# EasyEDA Pro project eLight_pro.eprj

# Schematic SCH
Create Date: 2023-01-14; Page Name: P1; Project Name: eLight_pro; Schematic Name: SCH; Update Date: 2023-04-07; Company: 嘉立创EDA; Page Size: A4; Version: V1.0
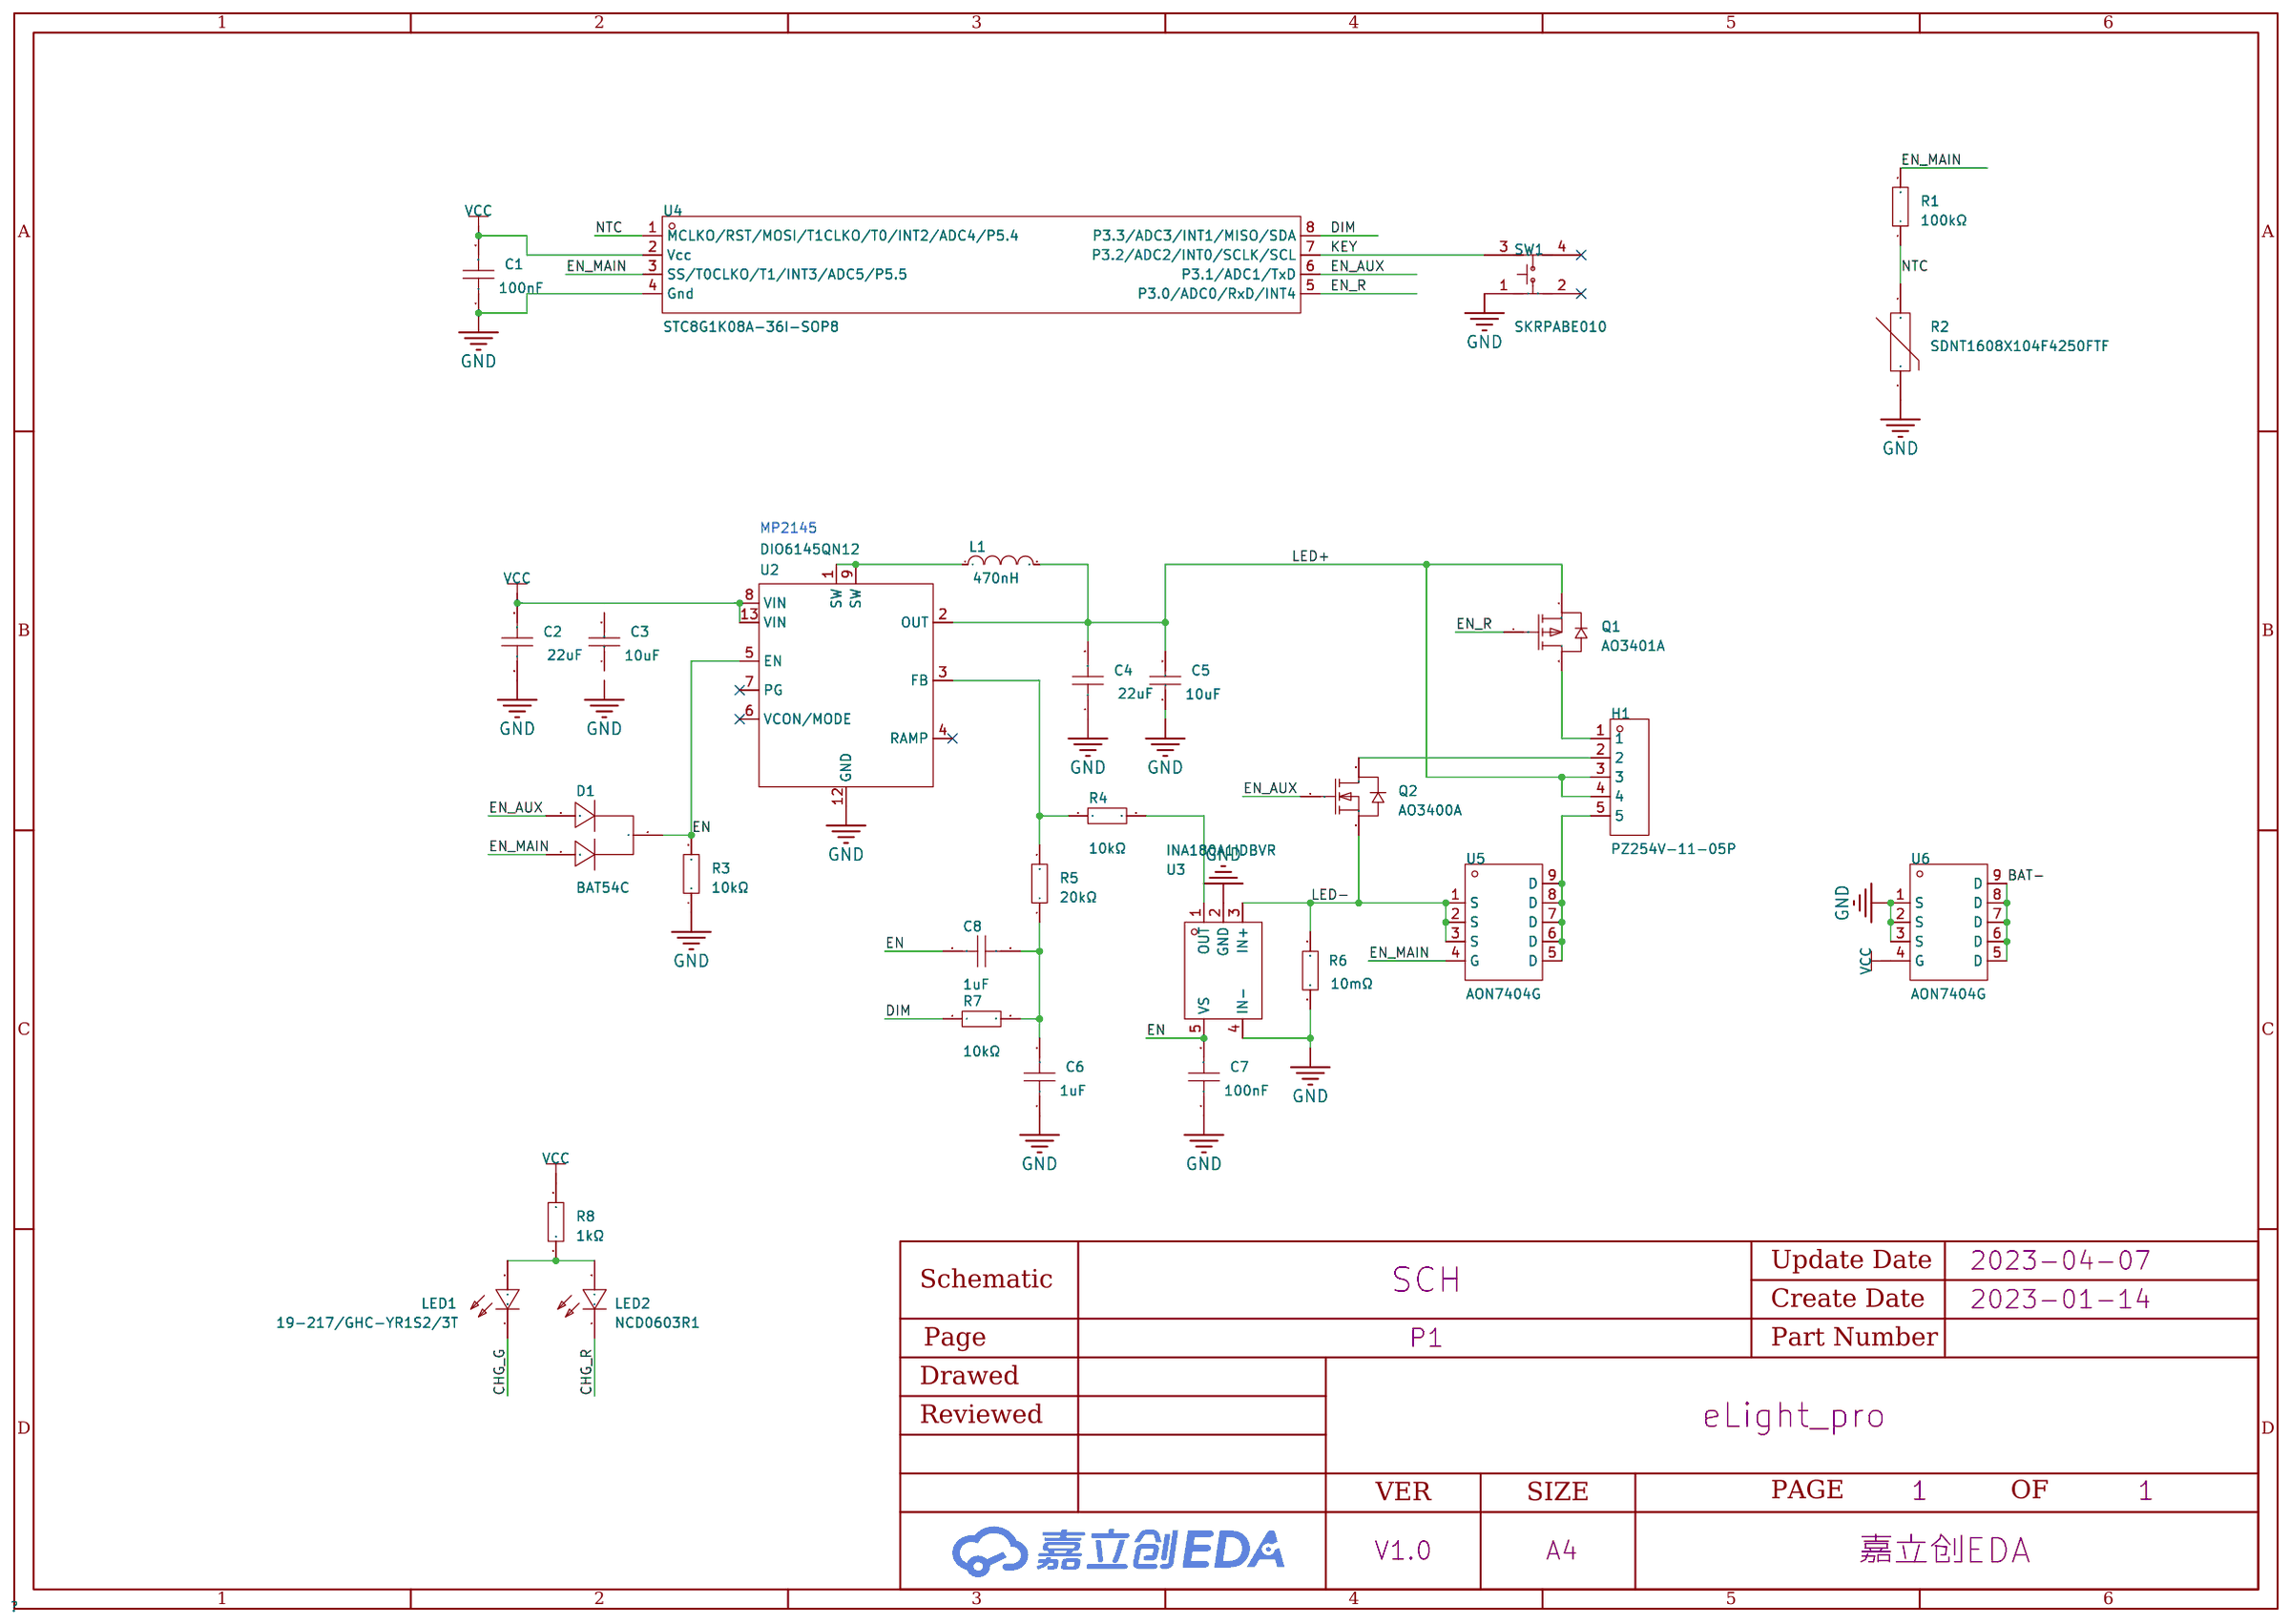
[diagram p0: schematic sheet]

## Parts
C1  100nF  [C0603]
C2  22uF  [C0805]
C3  10uF  [C0603]
C4  22uF  [C0805]
C5  10uF  [C0603]
C6  1uF  [C0603]
C7  100nF  [C0603]
C8  1uF  [C0603]
D1  BAT54C  [SOT-23-3_L2.9-W1.6-P1.90-LS2.8-BR]
H1  PZ254V-11-05P  [HDR-TH_5P-P2.54-V-M]
L1  470nH  [IND-SMD_L4.4-W4.2]
LED1  19-217/GHC-YR1S2/3T  [LED0603-RD]
LED2  NCD0603R1  [LED0603-RD_RED]
Q1  AO3401A  [SOT-23_L2.9-W1.3-P1.90-LS2.4-BR]
Q2  AO3400A  [SOT-23-3_L2.9-W1.6-P1.90-LS2.8-BR]
R1  100kΩ  [R0603]
R2  SDNT1608X104F4250FTF  [R0603]
R3  10kΩ  [R0603]
R4  10kΩ  [R0603]
R5  20kΩ  [R0603]
R6  10mΩ  [R1206]
R7  10kΩ  [R0603]
R8  1kΩ  [R0603]
SW1  SKRPABE010  [KEY-SMD_4P-L4.2-W3.2-P2.20-LS4.6]
U2  DIO6145QN12  [QFN-12_L3.0-W2.0-P0.50_DIO6145QN12]
U3  INA180A1IDBVR  [SOT-23-5_L3.0-W1.7-P0.95-LS2.8-BR]
U4  STC8G1K08A-36I-SOP8  [SOP-8_L5.0-W4.0-P1.27-LS6.0-BL]
U5  AON7404G  [DFN-8_L3.0-W3.0-P0.65-BL-2]
U6  AON7404G  [DFN-8_L3.0-W3.0-P0.65-BL-2]

## Library data of the parts
C1 C7 = CC0603KRX7R9BB104: 容值:100nF;精度:±10%;额定电压:50V;材质(温度系数):X7R;; LCSC Part Name: 100nF ±10% 50V; Supplier Part: C14663; Manufacturer: YAGEO(国巨); Supplier Footprint: 0603; JLCPCB Part Class: Basic Part; Datasheet: https://atta.szlcsc.com/upload/public/pdf/source/20170116/1484561234239.pdf; Supplier: LCSC; Tolerance: ±10%; Voltage Rated: 50V; Temperature Coefficient: X7R
C2 C4 = CL21A226MAQNNNE_C45783: 容值:22uF;精度:±20%;额定电压:25V;材质(温度系数):X5R;; LCSC Part Name: 22uF ±20% 25V; Supplier Part: C45783; Manufacturer: SAMSUNG(三星); Manufacturer Part: CL21A226MAQNNNE; Supplier Footprint: 0805; JLCPCB Part Class: Basic Part; Datasheet: https://atta.szlcsc.com/upload/public/pdf/source/20160103/1457707727161.pdf; Supplier: LCSC; Tolerance: ±20%; Voltage Rated: 25V; Temperature Coefficient: X5R
C3 C5 = CL10A106KP8NNNC: 容值:10uF;精度:±10%;额定电压:10V;材质(温度系数):X5R;; LCSC Part Name: 10uF ±10% 10V; Supplier Part: C19702; Manufacturer: SAMSUNG(三星); Supplier Footprint: 0603; JLCPCB Part Class: Basic Part; Datasheet: https://atta.szlcsc.com/upload/public/pdf/source/20160103/1457707703378.pdf; Supplier: LCSC; Tolerance: ±10%; Voltage Rated: 10V; Temperature Coefficient: X5R
C6 C8 = CL10A105KB8NNNC: 温度系数:X5R;精度:±10%;额定电压:50V;容值:1uF;; LCSC Part Name: 1uF ±10% 50V; Supplier Part: C15849; Manufacturer: SAMSUNG(三星); Supplier Footprint: 0603; JLCPCB Part Class: Basic Part; Datasheet: https://atta.szlcsc.com/upload/public/pdf/source/20160103/1457707679084.pdf; Supplier: LCSC; Tolerance: ±10%; Voltage Rated: 50V; Temperature Coefficient: X5R
D1 = BAT54C_C2135: 二极管配置:-;直流反向耐压(Vr):30V;平均整流电流(Io):200mA;正向压降(Vf):1V@100mA;反向电流(Ir):-;; LCSC Part Name: 30V 200mA 1V@100mA; Supplier Part: C2135; Manufacturer: CJ(江苏长电/长晶); Supplier Footprint: SOT-23; JLCPCB Part Class: Extended Part; Datasheet: https://atta.szlcsc.com/upload/public/pdf/source/20140809/1457707208935.pdf; Supplier: LCSC; Reverse Voltage (Vr): 30V; Average Rectified Current (Io): 200mA; Forward Voltage (Vf@If): 1V@100mA
H1 = PZ254V-11-05P: 排数:单排;总PIN位数:5;间距:2.54mm;插针结构:1x5P;行距:-;安装类型:直插;圆针/方针:方针;额定电流:-;额定电压:-;配合针长度:6mm;塑高:2.5mm;端接针长度:3mm;触头材质:黄铜;触头镀层:-;工作温度范围:-40℃~+105℃;颜色:黑色;; LCSC Part Name: 2.54mm 1x5P 直插 方针; Supplier Part: C492404; Manufacturer: XFCN(兴飞); Supplier Footprint: 插件,P=2.54mm; JLCPCB Part Class: Extended Part; Datasheet: https://atta.szlcsc.com/upload/public/pdf/source/20200309/C492404_E51533260F8710EFF5D4617281164C1D.pdf; Supplier: LCSC; Number of Rows: 单排; Number of Pins: 5; Pitch: 2.54mm; Pin Structure: 1x5P; Mounting Type: 直插; Circluar Pins/Square Pins: 方针; Length of Mating Pin: 6mm; Insulation Height: 2.5mm; Length of End Connection Pin: 3mm; Contact Material: 黄铜; Operating Temperature Range: -40℃~+105℃; Color: 黑色
L1 = FXL0420-R47-M: 电感值:470nH;精度:±20%;额定电流:7.5A;饱和电流(Isat):9.5A;直流电阻(DCR):12.5mΩ;; LCSC Part Name: 470nH ±20% 7.5A 12.5mΩ; Supplier Part: C167200; Manufacturer: cjiang(长江微电); Supplier Footprint: SMD,4.4x4.2x1.8mm; JLCPCB Part Class: Extended Part; Datasheet: https://atta.szlcsc.com/upload/public/pdf/source/20190322/C167200_20D2BEC67E3458D1D3C41374BE294EB4.pdf; Supplier: LCSC; Tolerance: ±20%; Rated Current: 7.5A; Saturation Current (Isat): 9.5A; DC Resistance (DCR): 12.5mΩ
LED1 = 19-217/GHC-YR1S2/3T: 发光颜色:翠绿;二极管配置:-;透镜颜色:无色透明;主波长:520nm~535nm;峰值波长:518nm;色温:-;测试电流:20mA;功率:110mW;发光角度:120°;安装方式:-;工作温度:-40℃~+85℃;; LCSC Part Name: 翠绿 520nm~535nm; Supplier Part: C72043; Manufacturer: EVERLIGHT(亿光); Supplier Footprint: 0603; JLCPCB Part Class: Basic Part; Datasheet: https://atta.szlcsc.com/upload/public/pdf/source/20160507/1462613613780.pdf; Supplier: LCSC; Emitted Color: 翠绿; Lens Color: 无色透明; Dominant Wavelength: 520nm~535nm; Peak Wavelength: 518nm; Forward Current: 20mA; Power Dissipation: 110mW; Viewing Angle: 120°; Operating Temperature: -40℃~+85℃
LED2 = NCD0603R1_C84263: 发光颜色:红灯;; LCSC Part Name: 红灯; Supplier Part: C84263; Manufacturer: 国星光电; Supplier Footprint: 0603; JLCPCB Part Class: Extended Part; Datasheet: https://atta.szlcsc.com/upload/public/pdf/source/20200820/C84263_DABC6A75E58F576973B407FDBA283D60.pdf; Supplier: LCSC; Emitted Color: 红灯
Q1 = AO3401A_C15127: 类型:P沟道;漏源电压(Vdss):30V;连续漏极电流(Id):4A;功率(Pd):1.4W;导通电阻(RDS(on)@Vgs,Id):44mΩ@10V,4.3A;阈值电压(Vgs(th)@Id):1.3V@250uA;; LCSC Part Name: P沟道 30V 4A; Supplier Part: C15127; Manufacturer: AOS; Supplier Footprint: SOT-23-3L; JLCPCB Part Class: Basic Part; Datasheet: https://atta.szlcsc.com/upload/public/pdf/source/20160507/1462613609053.pdf; Supplier: LCSC; Type: P沟道; Drain Source Voltage (Vdss): 30V; Continuous Drain Current (Id): 4A; Power Dissipation (Pd): 1.4W; Drain Source On Resistance (RDS(on)@Vgs,Id): 44mΩ@10V,4.3A; Gate Threshold Voltage (Vgs(th)@Id): 1.3V@250uA
Q2 = AO3400A_C20917: 类型:N沟道;漏源电压(Vdss):30V;连续漏极电流(Id):5.7A;功率(Pd):1.4W;导通电阻(RDS(on)@Vgs,Id):26.5mΩ@10V,5.7A;阈值电压(Vgs(th)@Id):1.5V@250uA;; LCSC Part Name: N沟道 30V 5.7A; Supplier Part: C20917; Manufacturer: AOS; Supplier Footprint: SOT-23; JLCPCB Part Class: Basic Part; Datasheet: https://atta.szlcsc.com/upload/public/pdf/source/20140107/1457706668533.pdf; Supplier: LCSC; Type: N沟道; Drain Source Voltage (Vdss): 30V; Continuous Drain Current (Id): 5.7A; Power Dissipation (Pd): 1.4W; Drain Source On Resistance (RDS(on)@Vgs,Id): 26.5mΩ@10V,5.7A; Gate Threshold Voltage (Vgs(th)@Id): 1.5V@250uA
R1 = 0603WAF1003T5E: 电阻类型:厚膜电阻;阻值:100kΩ;精度:±1%;功率:100mW;温度系数:±100ppm/℃;最大工作电压:75V;工作温度范围:-55℃~+155℃;; LCSC Part Name: 100kΩ ±1% 100mW; Supplier Part: C25803; Manufacturer: UNI-ROYAL(厚声); Supplier Footprint: 0603; JLCPCB Part Class: Basic Part; Datasheet: https://atta.szlcsc.com/upload/public/pdf/source/20200306/C422600_1E6D84923E4A46A82E41ADD87F860B5C.pdf; Supplier: LCSC; Type: 厚膜电阻; Tolerance: ±1%; Power(Watts): 100mW; Temperature Coefficient: ±100ppm/℃; Overload Voltage (Max): 75V; Operating Temperature Range: -55℃~+155℃
R2 = SDNT1608X104F4250FTF: 阻值(25℃):100kΩ;电阻精度:±1%;B值精度:±1%;B值(25℃/50℃):4250K;功率:100mW;最大稳态电流(25℃):100uA;B值(25℃/75℃):-;B值(25℃/85℃):-;B值(25℃/100℃):-;工作温度:-55℃~+125℃;; LCSC Part Name: 100kΩ 电阻精度:±1% 4250K; Supplier Part: C95955; Manufacturer: Sunlord(顺络); Supplier Footprint: 0603; JLCPCB Part Class: Extended Part; Datasheet: https://atta.szlcsc.com/upload/public/pdf/source/20210916/BF106A3565EDFEB141CB3E0EA3A661F8.pdf; Supplier: LCSC; Resistance @ 25℃: 100kΩ; Resistance Tolerance: ±1%; B Constant Tolerance: ±1%; B Constant (25℃/50℃): 4250K; Power: 100mW; Steady State Current (Max): 100uA; Operating Temperature: -55℃~+125℃
R3 R4 R7 = 0603WAF1002T5E: 电阻类型:厚膜电阻;阻值:10kΩ;精度:±1%;功率:100mW;温度系数:±100ppm/℃;最大工作电压:75V;工作温度范围:-55℃~+155℃;; LCSC Part Name: 10kΩ ±1% 100mW; Supplier Part: C25804; Manufacturer: UNI-ROYAL(厚声); Supplier Footprint: 0603; JLCPCB Part Class: Basic Part; Datasheet: https://atta.szlcsc.com/upload/public/pdf/source/20200306/C422600_1E6D84923E4A46A82E41ADD87F860B5C.pdf; Supplier: LCSC; Type: 厚膜电阻; Tolerance: ±1%; Power(Watts): 100mW; Temperature Coefficient: ±100ppm/℃; Overload Voltage (Max): 75V; Operating Temperature Range: -55℃~+155℃
R5 = 0603WAF2002T5E: 精度:±1%;温度系数:±100ppm/℃;阻值:20kΩ;功率:1/10W;最大工作电压:75V;工作温度范围:-55℃~+155℃;; LCSC Part Name: 20KΩ ±1%; Supplier Part: C4184; Manufacturer: UNI-ROYAL(厚声); Supplier Footprint: 0603; JLCPCB Part Class: Basic Part; Datasheet: https://atta.szlcsc.com/upload/public/pdf/source/20170920/C4184_1505887495503980652.pdf; Supplier: LCSC; Tolerance: ±1%; Temperature Coefficient: ±100ppm/℃; Power(Watts): 1/10W; Overload Voltage (Max): 75V; Operating Temperature Range: -55℃~+155℃; Type: 厚膜电阻
R6 = FMF06FTHR010-LH: 阻值:10mΩ;精度:±1%;功率:1W;温度系数:±70ppm/℃;; LCSC Part Name: 10mΩ ±1% 1W; Supplier Part: C105362; Manufacturer: PSA(信昌电陶); Supplier Footprint: 1206; JLCPCB Part Class: Extended Part; Datasheet: https://atta.szlcsc.com/upload/public/pdf/source/20170410/1491788444486.pdf; Supplier: LCSC; Tolerance: ±1%; Power(Watts): 1W; Temperature Coefficient: ±70ppm/℃
R8 = 0603WAF1001T5E: 电阻类型:厚膜电阻;阻值:1kΩ;精度:±1%;功率:100mW;温度系数:±100ppm/℃;最大工作电压:75V;工作温度范围:-55℃~+155℃;; LCSC Part Name: 1kΩ ±1% 100mW; Supplier Part: C21190; Manufacturer: UNI-ROYAL(厚声); Supplier Footprint: 0603; JLCPCB Part Class: Basic Part; Datasheet: https://atta.szlcsc.com/upload/public/pdf/source/20200306/C422600_1E6D84923E4A46A82E41ADD87F860B5C.pdf; Supplier: LCSC; Type: 厚膜电阻; Tolerance: ±1%; Power(Watts): 100mW; Temperature Coefficient: ±100ppm/℃; Overload Voltage (Max): 75V; Operating Temperature Range: -55℃~+155℃
SW1 = SKRPABE010: 触点电流:50mA;额定电压(DC):16V;电路结构:单刀单掷;按钮作用方向:顶部触动;致动器样式:椭圆形按钮;照明颜色:-;开关长度:4.2mm;开关宽度:3.2mm;开关高度:2.5mm;; LCSC Part Name: 3.2*4.2*2.5，1.57N; Supplier Part: C115360; Manufacturer: ALPSALPINE(阿尔卑斯阿尔派); Supplier Footprint: SMD; JLCPCB Part Class: Extended Part; Datasheet: https://atta.szlcsc.com/upload/public/pdf/source/20170620/1497944816225.pdf; Supplier: LCSC; Contact Current: 50mA; Voltage Rating (DC): 16V; Circuit: 单刀单掷; Actuator Orientation: 顶部触动; Actuator Style: 椭圆形按钮; Switch Length: 4.2mm; Switch Width: 3.2mm; Switch Height: 2.5mm
U2 = DIO6145QN12: Supplier Part: C2980987; Manufacturer: DIOO(帝奥微); Supplier Footprint: QFN-12(2x3); JLCPCB Part Class: Extended Part; Supplier: LCSC
U3 = INA180A1IDBVR: INA180 INA180 多通道电流感应放大器; Supplier Part: C122228; Manufacturer: TI(德州仪器); Supplier Footprint: SOT-23-5; JLCPCB Part Class: Extended Part; Datasheet: https://atta.szlcsc.com/upload/public/pdf/source/20190308/C122228_29623D128362F1CBFB59AB6E2997A932.pdf; Supplier: LCSC
U4 = STC8G1K08A-36I-SOP8: CPU内核:51系列;CPU最大主频:-;工作电压范围:1.9V~5.5V;内部振荡器:有;外部时钟频率范围:-;程序 FLASH容量:8KB;RAM总容量:1.25KB;EEPROM/数据 FLASH容量:4KB;GPIO端口数量:6;ADC(单元数/通道数/位数):1@x6ch/10bit;DAC(单元数/通道数/位数):-;(E)PWM(单元数/通道数/位数):-;8位Timer数量:-;16位Timer数量:2;32位Timer数量:-;内部比较器数量:-;U(S)ART路数:1;I2C路数:1;; LCSC Part Name: 51系列 闪存：8KB RAM：1.25KB; Supplier Part: C915663; Manufacturer: STC(宏晶); Supplier Footprint: SOP-8-4.0mm; JLCPCB Part Class: Extended Part; Datasheet: https://atta.szlcsc.com/upload/public/pdf/source/20201105/C713818_1666C7558605C197DBF08446D241F69F.pdf; Supplier: LCSC; CPU Core: 51系列; Supply Voltage Range: 1.9V~5.5V; Internal Oscillator: 有; Program FLASH Size: 8KB; RAM Size: 1.25KB; EEPROM/Data FLASH Size: 4KB; GPIO Ports Number: 6; ADC (Units/Channels/bits): 1@x6ch/10bit; 16Bit Timer Number: 2; U(S)ART Number: 1; I2C Number: 1; (Q)SPI Number: 1; Peripherals / Functions / Protocol Stacks: 低电压检测；看门狗；CCP捕获/比较；除法器；乘法器; Operating Temperature Range: -40℃~+85℃
U5 U6 = AON7404G: 类型:N沟道;漏源电压(Vdss):20V;连续漏极电流(Id):20A；20A;功率(Pd):5W；28W;导通电阻(RDS(on)@Vgs,Id):5.3mΩ@20A,4.5V;阈值电压(Vgs(th)@Id):1.25V@250uA;栅极电荷(Qg@Vgs):45nC@4.5V;输入电容(Ciss@Vds):3.3nF@10V;工作温度:-55℃~+150℃@(Tj);; LCSC Part Name: N沟道 20V 20A 20A; Supplier Part: C3288325; Manufacturer: AOS; Supplier Footprint: DFN-8_EP(3x3); Supplier: LCSC; Type: N沟道; Drain Source Voltage (Vdss): 20V; Continuous Drain Current (Id): 20A；20A; Power Dissipation (Pd): 5W；28W; Drain Source On Resistance (RDS(on)@Vgs,Id): 5.3mΩ@20A,4.5V; Gate Threshold Voltage (Vgs(th)@Id): 1.25V@250uA; Total Gate Charge (Qg@Vgs): 45nC@4.5V; Input Capacitance (Ciss@Vds): 3.3nF@10V; Operating Temperature: -55℃~+150℃@(Tj)

## Nets
GND: C1.1 C2.1 C4.1 C5.1 C6.1 C7.1 R2.1 R3.1 R6.1 SW1.1 U2.12(GND) U3.2(GND) U3.4(IN-) U4.4(Gnd) U6.1(S) U6.2(S) U6.3(S)
VCC: C1.2 C2.2 R8.2 U2.8(VIN) U2.13(VIN) U4.2(Vcc) U6.4(G)
BAT-: U6.5(D) U6.6(D) U6.7(D) U6.8(D) U6.9(D)
CHG_G: LED1.1(C)
CHG_R: LED2.1(K)
DIM: R7.1 U4.8(P3.3/ADC3/INT1/MISO/SDA)
EN: C7.2 C8.2 D1.3(K) R3.2 U2.5(EN) U3.5(VS)
EN_AUX: D1.1(A1) Q2.1(G) U4.6(P3.1/ADC1/TxD)
EN_MAIN: D1.2(A2) R1.2 U4.3(SS/T0CLKO/T1/INT3/ADC5/P5.5) U5.4(G)
EN_R: Q1.1(G) U4.5(P3.0/ADC0/RxD/INT4)
KEY: SW1.3 U4.7(P3.2/ADC2/INT0/SCLK/SCL)
LED+: C4.2 C5.2 H1.3 H1.4 L1.2 Q1.2(S) U2.2(OUT)
LED-: Q2.2(S) R6.2 U3.3(IN+) U5.1(S) U5.2(S) U5.3(S)
NTC: R1.1 R2.2 U4.1(MCLKO/RST/MOSI/T1CLKO/T0/INT2/ADC4/P5.4)
$1N3392: R4.1 R5.2 U2.3(FB)
$1N43155: L1.1 U2.1(SW) U2.9(SW)
$1N44128: R4.2 U3.1(OUT)
$1N45108: LED1.2(A) LED2.2(A) R8.1
$1N49420: H1.5 U5.5(D) U5.6(D) U5.7(D) U5.8(D) U5.9(D)
$1N49493: H1.2 Q2.3(D)
$1N49497: H1.1 Q1.3(D)
$1N54255: C6.2 C8.1 R5.1 R7.2

Not connected (* = marked no-connect by the designer): C3 1 2; SW1 2* 4*; U2 4(RAMP)* 6(VCON/MODE)* 7(PG)*

## Notes on the sheet
- MP2145

# Board PCB
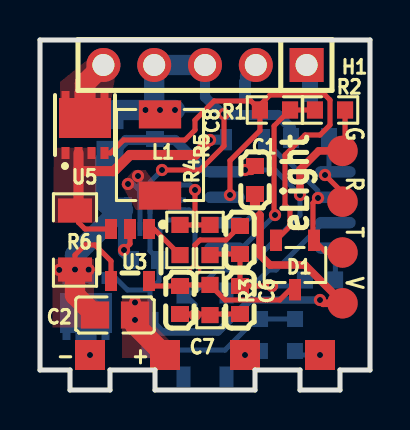
[diagram p1: board, top side]
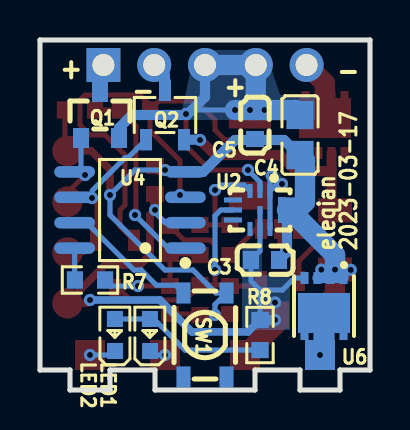
[diagram p2: board, bottom side, seen from below]

Outline 16.5 x 17.5 mm; copper layers: Top Layer, Bottom Layer. Coordinates in mm from the lower left corner of the outline.
Outline path: 0,17.5 0,1 1.5,1 1.5,0 3.5,0 3.5,1 5.75,1 5.75,0 10.75,0 10.75,1 13,1 13,0 15,0 15,1 16.5,1 16.5,17.5 0,17.5
Stack: Top Layer 0.035mm / Dielectric1 0.91mm FR4 er 4.5 / Bottom Layer 0.035mm

## Design rules (mm)
template: 用户自定义配置
spacing safeClearance (default): track to track 0.152, other pairs 0.152 to 0.3
track width trackWidth (default): min 0.127, default 0.254, max 2.54
differential pair differentialPair (default): width min 0.127, default 0.254, max 2.54; gap min 0.152, default 0.152
via viaSize (default): diameter min 0.5, default 0.61, max 10; hole min 0.3, default 0.305, max 5.999
net GND uses copperRegion1
net LED+ uses copperRegion1

## Placement (name value [footprint] x y rotation side)
C1  100nF  [C0603]  10.75 10.5 270 top
C2  22uF  [C0805]  3.75 3.75 0 top
C3  10uF  [C0603]  5.25 6.5 0 bottom
C4  22uF  [C0805]  3.5 12.75 90 bottom
C5  10uF  [C0603]  5.75 13.25 90 bottom
C6  1uF  [C0603]  10 4.5 90 top
C7  100nF  [C0603]  7 4.5 90 top
C8  1uF  [C0603]  10 7.5 90 top
D1  BAT54C  [SOT-23-3_L2.9-W1.6-P1.90-LS2.8-BR]  12.75 6.25 90 top
H1  PZ254V-11-05P  [HDR-TH_5P-P2.54-V-M]  8.25 16.25 180 top
L1  470nH  [IND-SMD_L4.4-W4.2]  6 11.75 270 top
LED1  19-217/GHC-YR1S2/3T  [LED0603-RD]  11 2.75 90 bottom
LED2  NCD0603R1  [LED0603-RD_RED]  12.75 2.75 90 bottom
NOREF  -  [Pad_e53]  2.5 1.75 0 top
NOREF#2  -  [Pad_e2023]  15.12 4.34 270 top
NOREF#3  -  [Pad_e71]  14 1.75 0 top
NOREF#4  -  [Pad_e54]  6.25 1.75 0 top
NOREF#5  -  [Pad_e75]  2.5 1.75 0 top
NOREF#6  -  [Pad_e663]  15.12 6.88 270 top
NOREF#7  -  [Pad_e55]  10.25 1.75 0 top
NOREF#8  -  [Pad_e660]  15.12 9.42 270 top
NOREF#9  -  [Pad_e664]  15.12 11.96 270 top
Q1  AO3401A  [SOT-23_L2.9-W1.3-P1.90-LS2.4-BR]  13.5 13.75 270 bottom
Q2  AO3400A  [SOT-23-3_L2.9-W1.6-P1.90-LS2.8-BR]  10.25 13.75 270 bottom
R1  100kΩ  [R0603]  11.75 14 180 top
R2  SDNT1608X104F4250FTF  [R0603]  14.5 14 180 top
R3  10kΩ  [R0603]  8.5 4.5 90 top
R4  10kΩ  [R0603]  7 7.5 270 top
R5  20kΩ  [R0603]  8.5 7.5 90 top
R6  10mΩ  [R1206]  1.75 7.5 90 top
R7  10kΩ  [R0603]  14 5.5 180 bottom
R8  1kΩ  [R0603]  5.5 2.75 90 bottom
SW1  SKRPABE010  [KEY-SMD_4P-L4.2-W3.2-P2.20-LS4.6]  8.25 2.75 270 bottom
U2  DIO6145QN12  [QFN-12_L3.0-W2.0-P0.50_DIO6145QN12]  5.5 9 270 bottom
U3  INA180A1IDBVR  [SOT-23-5_L3.0-W1.7-P0.95-LS2.8-BR]  4.5 6.75 90 top
U4  STC8G1K08A-36I-SOP8  [SOP-8_L5.0-W4.0-P1.27-LS6.0-BL]  12 9 90 bottom
U5  AON7404G  [DFN-8_L3.0-W3.0-P0.65-BL-2]  2.25 13.25 0 top
U6  AON7404G  [DFN-8_L3.0-W3.0-P0.65-BL-2]  2.3 4.2 0 bottom

## Footprints (pads in the part's own frame, mm; a bottom-side part is the same pattern mirrored in y, then rotated)
C0603
  rect 0.8x0.9 smd: 1(-0.7,0) 2(0.7,0)
C0805
  rect 1.41x1.35 smd: 1(-1,0) 2(1,0)
DFN-8_L3.0-W3.0-P0.65-BL-2
  rect 0.4x0.6 smd: 1(-0.975,-1.4) 2(-0.325,-1.4) 3(0.325,-1.4) 4(0.975,-1.4) 5(0.975,1.4) 6(0.325,1.4) 7(-0.325,1.4) 8(-0.975,1.4)
  rect 2.6x2 smd: 9(0,0.35)
HDR-TH_5P-P2.54-V-M
  rect 1.7x1.7 hole 1.1: 1(-5.08,0)
  round 1.7 hole 1.1: 2(-2.54,0) 3(0,0) 4(2.54,0) 5(5.08,0)
IND-SMD_L4.4-W4.2
  rect 1.4x2.12 smd: 1(2.028,0) 2(-2.028,0)
KEY-SMD_4P-L4.2-W3.2-P2.20-LS4.6
  rect 1.05x0.7 smd: 1(-2.1,1.075) 2(2.1,1.075) 3(-2.1,-1.075) 4(2.1,-1.075)
LED0603-RD
  rect 0.8x0.8 smd: 1(-0.799,-0.004) 2(0.799,0.004)
LED0603-RD_RED
  rect 0.8x0.8 smd: 1(-0.799,-0.004) 2(0.799,0.004)
Pad_e53
  rect 1.5x1.5 smd: 1(0,0)
Pad_e54
  rect 1.5x1.5 smd: 2(0,0)
Pad_e55
  rect 1.5x1.5 smd: 3(0,0)
Pad_e71
  rect 1.5x1.5 smd: 4(0,0)
Pad_e75
  rect 1.5x1.5 smd far side: 1(0,0)
Pad_e660
  round 1.524 smd: 1(0,0)
Pad_e663
  round 1.524 smd: 1(0,0)
Pad_e664
  round 1.524 smd: 1(0,0)
Pad_e2023
  round 1.524 smd: 1(0,0)
QFN-12_L3.0-W2.0-P0.50_DIO6145QN12
  rect 0.7x0.25 smd: 1(-0.95,0.5) 2(-0.95,0) 3(-0.95,-0.5) 7(0.95,-0.5) 8(0.95,0) 9(0.95,0.5)
  rect 0.25x0.9 smd: 4(-0.5,-1.35) 5(0,-1.35) 6(0.5,-1.35)
  custom 1.3x0.9 smd: 12(0,1.35)
  rect 0.4x0.25 smd: 13(0,0)
R0603
  rect 0.806x0.864 smd: 1(-0.753,0) 2(0.753,0)
R1206
  rect 1.208x1.701 smd: 1(-1.479,0) 2(1.479,0)
SOP-8_L5.0-W4.0-P1.27-LS6.0-BL
  oval 0.574x2.035 smd: 1(-1.905,-2.768) 2(-0.635,-2.768) 3(0.635,-2.768) 4(1.905,-2.768) 5(1.905,2.768) 6(0.635,2.768) 7(-0.635,2.768) 8(-1.905,2.768)
SOT-23-3_L2.9-W1.6-P1.90-LS2.8-BR
  rect 1.07x0.6 smd: 1(1.235,-0.95) 2(1.235,0.95) 3(-1.235,0)
SOT-23-5_L3.0-W1.7-P0.95-LS2.8-BR
  rect 1x0.6 smd: 1(1.3,-0.95) 2(1.3,0) 3(1.3,0.95) 4(-1.3,0.95) 5(-1.3,-0.95)
SOT-23_L2.9-W1.3-P1.90-LS2.4-BR
  rect 1x0.8 smd: 1(1.15,-0.95) 2(1.15,0.95) 3(-1.15,0)

## Nets
GND: C1.1 C2.1 C4.1 C5.1 C6.1 C7.1 NOREF#9.1 R2.1 R3.1 R6.1 SW1.1 U2.12 U3.2 U3.4 U4.4 U6.1 U6.2 U6.3
VCC: C1.2 C2.2 NOREF#2.1 NOREF#4.2 R8.2 U2.8 U2.13 U4.2 U6.4
BAT-: NOREF.1 NOREF#5.1 U6.5 U6.6 U6.7 U6.8 U6.9
CHG_G: LED1.1 NOREF#7.3
CHG_R: LED2.1 NOREF#3.4
DIM: R7.1 U4.8
EN: C7.2 C8.2 D1.3 R3.2 U2.5 U3.5
EN_AUX: D1.1 NOREF#6.1 Q2.1 U4.6
EN_MAIN: D1.2 R1.2 U4.3 U5.4
EN_R: NOREF#8.1 Q1.1 U4.5
KEY: SW1.3 U4.7
LED+: C4.2 C5.2 H1.3 H1.4 L1.2 Q1.2 U2.2
LED-: Q2.2 R6.2 U3.3 U5.1 U5.2 U5.3
NTC: R1.1 R2.2 U4.1
$1N3392: R4.1 R5.2 U2.3
$1N43155: L1.1 U2.1 U2.9
$1N44128: R4.2 U3.1
$1N45108: LED1.2 LED2.2 R8.1
$1N49420: H1.5 U5.5 U5.6 U5.7 U5.8 U5.9
$1N49493: H1.2 Q2.3
$1N49497: H1.1 Q1.3
$1N54255: C6.2 C8.1 R5.1 R7.2

Pads without a net: C3 1 2; SW1 2 4; U2 4 6 7

## Via types
v1: diameter 0.61, hole 0.305, Top Layer to Bottom Layer, 29 vias

## Routing (per net, layer and track width the routed paths; a pad name or vN(x,y) marks a point on that pad's centre or on a via; arc(x,y) is an arc through that point)
GND: length 49.4
  Top Layer w0.254: C7.1 7.75,3.8 ; 7.75,3.8 v1(7.75,3.75) ; 7.75,3.8 C6.1 ; U3.4 3.55,6.45 2.75,7.25 2.25,7.25 1.75,6.75 v1(1.75,6.02) ; U3.2 4.5,7.3 v1(4.2,7) ; R2.1 15.25,11.96 ; v1(10.25,11) 10.35,11.1
  Top Layer w0.381: v1(13,9.75) 13,11.02 13.94,11.96 NOREF#9.1
  Top Layer w0.508: v1(10.25,11) 10.55,11 C1.1
  Top Layer w1.016: v1(1.75,6.02) 1.75,4.75 C2.1
  Bottom Layer w0.254: v1(7.75,3.75) 7.75,4.28 SW1.1 7.7,4.85 8.85,6 10.25,6 13,8.75 v1(13,9.75) 11.75,11 v1(10.25,11) 9.33,11 U4.4
  Bottom Layer w0.508: 3.5,11.7 4.3,12.5 6.75,12.5 8.34,10.91 U4.4 ; U6.3 U6.2 U6.1 ; 4.55,6.5 4.15,6.9 U2.12
  Bottom Layer w1.016: 1.75,6 1.75,6.75 4,9 U2.12 ; 3.61,9.04 3.25,9.4 3.25,11.45 3.5,11.7 C4.1
  vias: v1(0.96,6) v1(2.43,6.02)
VCC: length 32.4
  Top Layer w0.254: 14.98,4.34 NOREF#2.1
  Top Layer w0.381: v1(10.75,9) 11,8.75 11,6.75 11.5,6.25 13.25,6.25 14.98,4.52 14.98,4.34 14.16,4.34 v1(14,4.5)
  Top Layer w0.508: v1(10.75,9) C1.2
  Top Layer w1.016: C2.2 4.75,3.25 NOREF#4.2
  Bottom Layer w0.254: U2.13 U2.8 5.5,6.95 5.95,6.5 5.95,5.45 5.5,5 ; 3.28,5.6 3.78,5.6 4.38,5 5.5,5 ; v1(10.75,9) 10.75,8.88 10.23,8.36 U4.2 ; R8.2 5.5,5
  Bottom Layer w0.381: R8.2 6.1,2.9 8.9,2.9 10.5,4.5 v1(14,4.5)
  Bottom Layer w0.508: R8.2 v1(4.75,3.5)
  vias: v1(4.75,4.38)
BAT-: length 2.2
  Bottom Layer w1.016: U6.9 2.3,1.95 v1(2.5,1.75)
CHG_G: length 0.8
  Bottom Layer w0.254: LED1.1 10.8,1.75 v1(10.25,1.75)
CHG_R: length 1.3
  Bottom Layer w0.254: LED2.1 12.95,1.75 v1(14,1.75)
DIM: length 1.6
  Bottom Layer w0.254: R7.1 14.77,5.51 U4.8
EN: length 16
  Top Layer w0.254: 7.75,5.25 R3.2 9.25,4.5 11.98,4.5 12.5,5.02 ; 7.75,5.25 v1(7.75,6) 7.75,7.25 8,7.5 9.3,7.5 C8.2 ; 7.75,5.25 7,5.25 ; U3.5 5.7,5.2 C7.2
  Bottom Layer w0.254: U2.5 7.46,9 7.75,8.71 v1(7.75,6)
EN_AUX: length 8.9
  Top Layer w0.254: v1(13.9,9.6) 13.65,9.35 13.65,7.54 14.3,6.89 15.12,6.89 NOREF#6.1
  Bottom Layer w0.254: 13.88,9.64 13.88,9.61 v1(13.9,9.6) ; 13.88,9.64 U4.6 ; 13.88,9.64 13.88,9.97 12.24,11.61 12.1,11.61 Q2.1
EN_MAIN: length 27.4
  Top Layer w0.254: D1.2 12.5,8.19 12.5,9 12.25,9.25 12.25,11.75 13.25,12.75 14,12.75 14.5,13.25 14.5,14.5 14.25,14.75 11.5,14.75 11,14.25 R1.2 ; v1(9.5,9.75) 9.5,11.47 11,12.97 R1.2 ; R1.2 10.55,14.45 8.7,14.45 7.75,13.5 7.75,13 7.25,12.5 4.17,12.5 3.53,11.85 U5.4
  Bottom Layer w0.254: v1(9.5,9.75) 9.35,9.75 U4.3
EN_R: length 4
  Top Layer w0.254: v1(14.25,10.75) 15.12,9.88 NOREF#8.1
  Bottom Layer w0.254: 14.45,10.91 U4.5 ; 14.45,10.91 14.29,10.75 v1(14.25,10.75) ; 14.45,10.91 Q1.1
KEY: length 6.9
  Bottom Layer w0.254: U4.7 14.16,8.36 11.8,6 11.44,6 10.68,5.24 9.71,5.24 SW1.3
LED+: length 23.9
  Top Layer w0.254: v1(6.1,11) 8,11 9.2,12.2 v1(9.2,13.8)
  Bottom Layer w0.254: U2.2 5.5,10.4 v1(6.1,11) ; 9,14 v1(6.75,14)
  Bottom Layer w0.508: Q1.2 12.55,13.1 11.9,13.75 9.15,13.75 8.25,14.65 H1.3
  Bottom Layer w1.016: v1(6.75,14) v1(6,14) 5.71,14 ; H1.3 H1.4 5.71,14 ; 5.71,14 v1(5.27,14) 3.75,14 C4.2
LED-: length 13.3
  Top Layer w0.254: U3.3 2.25,8.05 1.92,8.38 1.92,8.98
  Top Layer w0.508: 1.92,11.06 1.92,8.98 ; 1.92,11.06 2.04,10.94 3.69,10.94 4.5,11.75 7.75,11.75 v1(8.5,12.5) ; 1.92,11.06 1.92,11.85
  Bottom Layer w0.508: v1(8.5,12.5) 8.51,12.52 Q2.2
NTC: length 10
  Top Layer w0.254: R2.2 12.5,14 11.7,13.2 11.7,8.8 v1(11.75,8.75)
  Bottom Layer w0.254: v1(11.75,8.75) 10.09,7.09 U4.1
$1N3392: length 5.2
  Top Layer w0.254: v1(7.75,10) 7.75,8.25 ; 7.75,8.25 R5.2 ; 7.75,8.25 R4.1
  Bottom Layer w0.254: U2.3 6.3,10.25 7.5,10.25 v1(7.75,10)
$1N43155: length 3.4
  Bottom Layer w0.254: U2.1 4.65,10.3 v1(4.4,10.3) ; U2.1 5,10.6 v1(4.9,10.7) ; U2.1 U2.9
$1N44128: length 2.1
  Top Layer w0.254: R4.2 5.7,8.05 U3.1
$1N45108: length 7.9
  Bottom Layer w0.254: LED2.2 LED1.2 10.8,3.55 9.25,2 R8.1
$1N49420: length 3
  Top Layer w1.016: U5.9 2.25,15.33 H1.5
$1N49493: length 1.5
  Bottom Layer w0.508: H1.2 10.25,15.71 Q2.3
$1N49497: length 1.3
  Bottom Layer w0.508: Q1.3 13.5,16.25
$1N54255: length 6.5
  Top Layer w0.254: R5.1 8.55,6.8 C8.1 C6.2 v1(11.6,5.2)
  Bottom Layer w0.254: v1(11.6,5.2) 12.95,5.2 R7.2

## Copper pours and planes (outline as drawn; the poured copper is in the pictures)
GND on Top Layer: 0.63,6.55 3.47,6.55 3.47,3.12 0.63,3.12
GND on Bottom Layer: 0,17.5 16.5,17.5 16.5,0 0,0
VCC on Top Layer: 4.1,4.58 7,4.58 7,1.6 4.1,1.6
VCC on Bottom Layer: 4,7.5 6.4,7.5 6.4,3 4,3
LED+ on Bottom Layer: 2.75,17 9.5,17 9.5,13.5 2.75,13.5
LED- on Top Layer: 0.67,12.11 2.81,12.11 2.81,8.36 0.67,8.36
$1N43155 on Top Layer: 4.05,11 7.05,11 7.05,9 4.05,9
$1N43155 on Bottom Layer: 4.1,11 5.3,11 5.3,9.95 4.1,9.95
$1N49420 on Top Layer: 1,17.1 3.9,17.1 3.9,14.1 1,14.1

## Text on the board
Bottom Silkscreen Layer: 2023-03-17 | eleqian | - | +
Top Silkscreen Layer: - | + | G | R | T | V | eLight
